# Altium schematic sheet Back.SchDoc
size A4; SheetNumber: 3; SheetTotal: 3
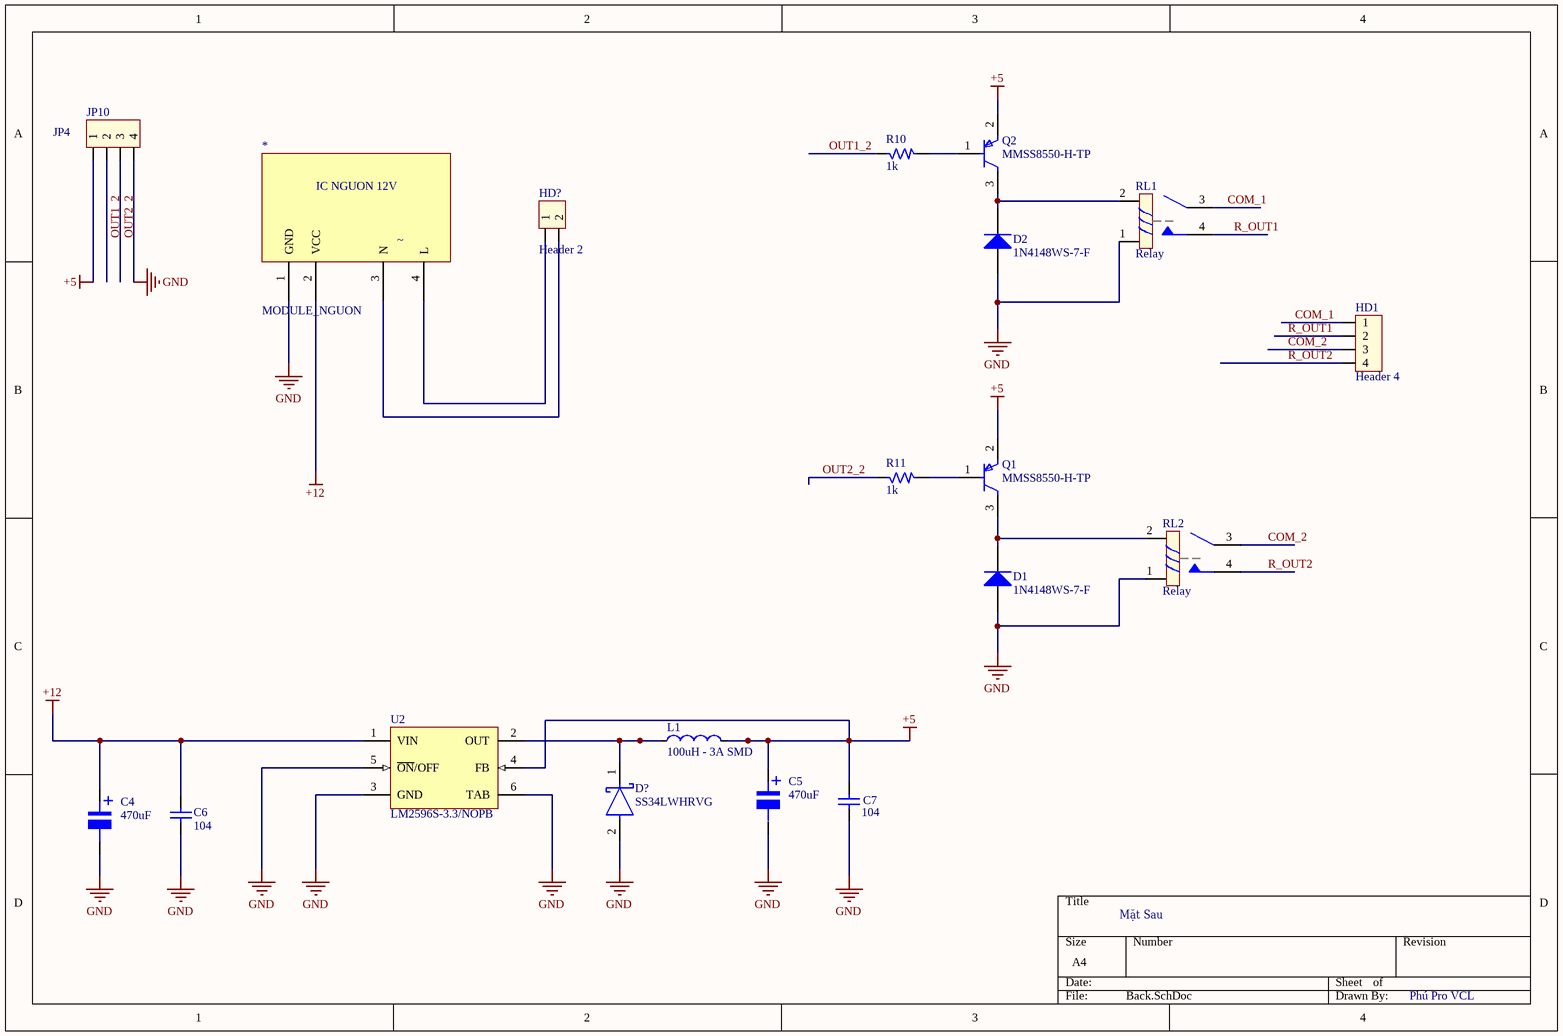
[diagram p0: Back.SchDoc]

## Parts
*  MODULE_NGUON  [NGUON_220_12]
C4  470uF  [tu nhom 8 (f)]
C5  470uF  [tu nhom 8 (f)]
C6  104  [tu 0805]
C7  104  [tu 0805]
D1  1N4148WS-7-F  [DIOD-SOD323-2-A_V]
D2  1N4148WS-7-F  [DIOD-SOD323-2-A_V]
D?  SS34LWHRVG  [FP-SS34LWH-MFG]
HD1  Header 4  [HED4]
HD?  Header 2  [HED2]
JP10  JP4  [CON4]
L1  100uH - 3A SMD  [Cuon Cam 12x12x10]
Q1  MMSS8550-H-TP  [FP-SOT-23-IPC_B]
Q2  MMSS8550-H-TP  [FP-SOT-23-IPC_B]
R10  1k  [RM-0805]
R11  1k  [RM-0805]
RL1  Relay  [HF46F]
RL2  Relay  [HF46F]
U2  LM2596S-3.3/NOPB  [KTT0005B_M]

## Nets
+5: C5.1 C7.1 JP10.1 L1.2 Q1.2(E) Q2.2(E) U2.4(FB)
+12: *.2(VCC) C4.1 C6.1 U2.1(VIN)
GND: *.1(GND) C4.2 C5.2 C6.2 C7.2 D1.1(A) D2.1(A) D?.2(A) JP10.4 RL1.1 RL2.1 U2.3(GND) U2.5(~{ON}/OFF) U2.6(TAB)
\: JP10.3 R11.1  [also labelled OUT2_2]
COM_1: HD1.1 RL1.3
COM_2: HD1.3 RL2.3
OUT1_2: JP10.2 R10.1
R_OUT1: HD1.2 RL1.4
R_OUT2: HD1.4 RL2.4
Net*_3: *.3(N) HD?.2
Net*_4: *.4(L) HD?.1
NetD1_2: D1.2(K) Q1.3(C) RL2.2
NetD2_2: D2.2(K) Q2.3(C) RL1.2
NetD?_1: D?.1(C) L1.1 U2.2(OUT)
NetQ1_1: Q1.1(B) R11.2
NetQ2_1: Q2.1(B) R10.2

## Notes on the sheet
- Mặt Sau
- Phú Pro VCL
- (in symbol MODULE_NGUON) IC NGUON 12V; ~
- (in symbol Tu Nhom 470uF 16V) +

## Library data of the parts
C4 C5 = Tu Nhom 470uF 16V: Dán; Don_Vi: Con; So_Chan: 2; Ten_Linh_Kien: Tụ Nhôm 470uF 16V 8x10.4MM; Ma_Hang: MH001940; Chung_Loai: Dán; Kieu_Chan: *
C6 C7 = Tu 0805 104 50V 10%: Dán; Don_Vi: Con; So_Chan: 2; Ten_Linh_Kien: Tụ 0805 104-100nF 10% 50V; Ma_Hang: MH004551; Chung_Loai: Dán; Kieu_Chan: *
D1 D2 = CMP-1667-00004-1: Fast Switching Diode, 75 V, 0.3 A, -65 to 150 degC, 2-Pin SOD323, RoHS, Tape and Reel; DatasheetVersion: Rev. 25-2, 03/2016; PackageDescription: 2-Pin Small Outline Diode, Body 1.7 x 1.3 mm; ComponentLink2Description: Datasheet; ComponentLink1URL: http://www.diodes.com/; PackageReference: SOD323-2; ComponentLink2URL: http://www.diodes.com/datasheets/ds30097.pdf; ComponentLink1Description: Manufacturer URL
D? = CMP-15604-000001-1: DIODE SCHOTTKY 40V 3A SOD123W; RoHS Compliant: Yes
HD1 = Hed4: Header 4 (Green); Value: Header 4
HD? = Hed2: Header 2 (Green); Value: Header 2
JP10 = Con4: Connector 4; Value: Connector 4
L1 = CUON CAM 100uH SMD: Dán; Don_Vi: Con; Ma_Hang: MH003999; Ten_Linh_Kien: Cuộn Cảm 100uH 7x7x4MM CD74; Ma_Hang: *; Kieu_Chan: *; Chung_Loai: Dán
Q1 Q2 = CMP-56214-000002-1: TRANS PNP 25V 1.5A SOT23; Emitter Base Voltage (VEBO): 1.6V; Collector Base Voltage (VCBO): 40V; Collector Emitter Saturation Voltage: 500mV; Max Power Dissipation: 625mW; Transition Frequency: 100MHz; Element Configuration: Single; hFE Min: 40; Polarity: PNP; Lead Free: Lead Free; Max Breakdown Voltage: 25V; Package Quantity: 1; Min Operating Temperature: -55°C; Case/Package: SOT-23; Max Collector Current: 1.5A; Mount: Surface Mount; Packaging: Tape and Reel; Collector Emitter Voltage (VCEO): 500mV; Max Operating Temperature: 150°C; Gain Bandwidth Product: 100MHz; Collector Emitter Breakdown Voltage: 25V
R10 R11 = R: Resistor 1/4W; Value: R1/4W - 1K
RL1 RL2 = Relay SPST-NO: Relay SPDT 4 Pin, HF161F-W or G4A-1A-PE; Value: Relay SPDT, 10A, 12V
U2 = CMP-0069-00275-3: SIMPLE SWITCHER® Power Converter 150 KHz 3A Step-Down Voltage Regulator, 5-pin TO-263, Pb-Free; Manufacturer: Texas Instruments; PackageTopMarking: NSUZXYTTE#*LM2596S*-3.3 P+; PowerWise: N; RoHS: Y; PackageReference: KTT0005B; PackageDescription: TO-263, Molded, .400 x .390 x .180in, 5 Lead, .067in Pitch, Surface Mount; PinCount: 5; ComponentLink1Description: Datasheet URL; Code_JEDEC: MO-169-AB; ComponentLink1URL: http://www.ti.com/general/docs/lit/getliterature.tsp?genericPartNumber=LM2596&fileType=pdf; CompType: Switcher